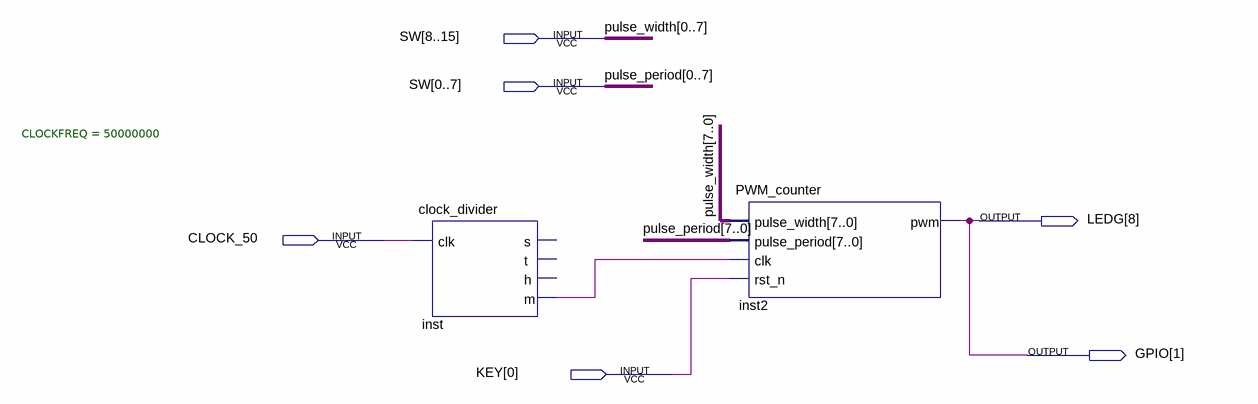
[diagram p0: schematic sheet]
// Quartus schematic PWM.bdf as structural Verilog: 2 symbols, 6 pins
module PWM (
  input  [0:15] SW,
  input  CLOCK_50,
  input  [0:0] KEY,
  output [8:8] LEDG,
  output [1:1] GPIO
);

  wire inst_m;

  clock_divider #(.CLOCKFREQ(50000000)) inst (.clk(CLOCK_50), .m(inst_m));  // open: s, t, h
  PWM_counter inst2 (
    .pulse_width({SW[15], SW[14], SW[13], SW[12], SW[11], SW[10], SW[9], SW[8]}),
    .pulse_period({SW[7], SW[6], SW[5], SW[4], SW[3], SW[2], SW[1], SW[0]}), .clk(inst_m), .rst_n(KEY[0]),
    .pwm(GPIO[1]));

  assign LEDG[8] = GPIO[1];

  // Other names for the same wires on the sheet: pulse_period[7:0] = {SW[7], SW[6], SW[5], SW[4], SW[3], SW[2], SW[1], SW[0]};
  //   pulse_width[7:0] = {SW[15], SW[14], SW[13], SW[12], SW[11], SW[10], SW[9], SW[8]}
endmodule
